# Altium project MB988.PrjPCB (part 2 of 2)

## Sheet Audio.SchDoc
size A4; Revision: B.2
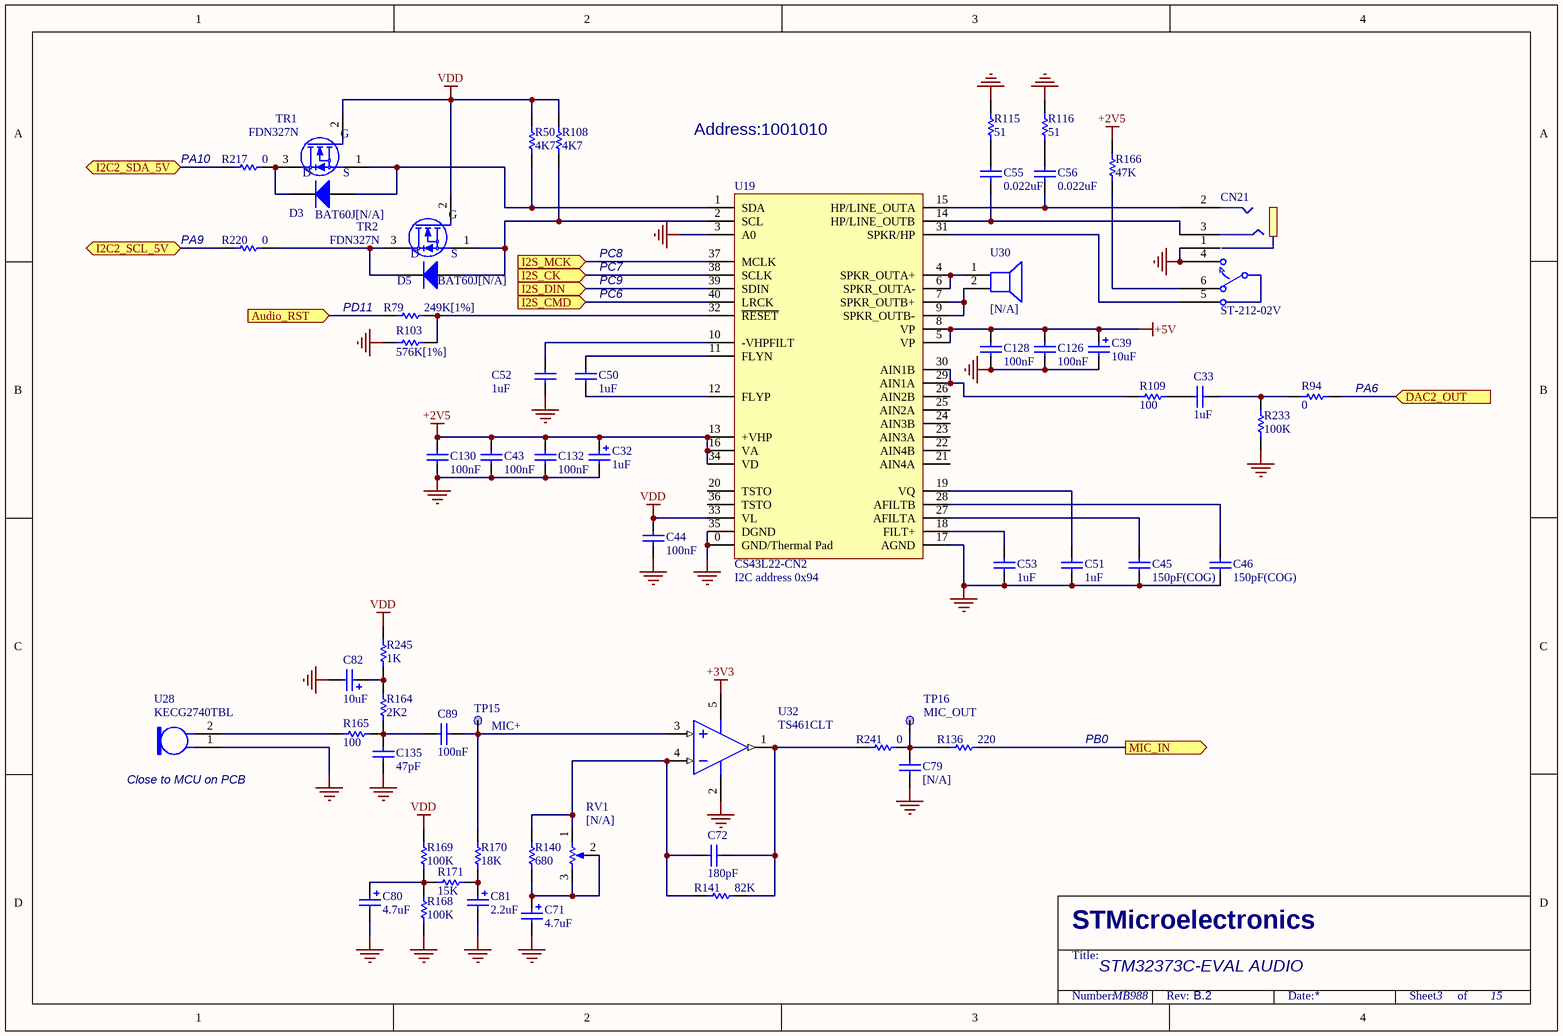
[diagram p9: Audio.SchDoc]

### Parts
C32  1uF  [TAN-A]
C33  1uF  [0603C]
C39  10uF  [TAN-A]
C43  100nF  [0603C]
C44  100nF  [0603C]
C45  150pF(COG)  [0603C]
C46  150pF(COG)  [0603C]
C50  1uF  [0603C]
C51  1uF  [0603C]
C52  1uF  [0603C]
C53  1uF  [0603C]
C55  0.022uF  [0603C]
C56  0.022uF  [0603C]
C71  4.7uF  [TAN-A]
C72  180pF  [0603C]
C79  [N/A]  [0603C]
C80  4.7uF  [TAN-A]
C81  2.2uF  [0805C]
C82  10uF  [TAN-A]
C89  100nF  [0603C]
C126  100nF  [0603C]
C128  100nF  [0603C]
C130  100nF  [0603C]
C132  100nF  [0603C]
C135  47pF  [0603C]
CN21  ST-212-02V  [ST-212-02V]
D3  BAT60J[N/A]  [SOD-323]
D5  BAT60J[N/A]  [SOD-323]
R50  4K7  [0603R]
R79  249K[1%]  [0603R]
R94  0  [0603R]
R103  576K[1%]  [0603R]
R108  4K7  [0603R]
R109  100  [0603R]
R115  51  [0603R]
R116  51  [0603R]
R136  220  [0603R]
R140  680  [0603R]
R141  82K  [0603R]
R164  2K2  [0603R]
R165  100  [0603R]
R166  47K  [0603R]
R168  100K  [0603R]
R169  100K  [0603R]
R170  18K  [0603R]
R171  15K  [0603R]
R217  0  [0603R]
R220  0  [0603R]
R233  100K  [0603R]
R241  0  [0603R]
R245  1K  [0603R]
RV1  [N/A]  [3314-J]
TP15  MIC+  [TP]
TP16  MIC_OUT  [TP]
TR1  FDN327N  [SOT-23]
TR2  FDN327N  [SOT-23]
U19  CS43L22-CN2  [QFN40(6*6)]
U28  KECG2740TBL  [KEC2740]
U30  [N/A]  [KS1708]
U32  TS461CLT  [SOT-23-5L]

### Ports
Audio_RST (in), DAC2_OUT (in), I2C2_SCL_5V (bidir), I2C2_SDA_5V (bidir), I2S_CK (in), I2S_CMD (in), I2S_DIN (in), I2S_MCK (in), MIC_IN (out)

### Nets
+2V5: C32.1 C43.1 C130.1 C132.1 R166.1 U19.13(+VHP) U19.16(VA) U19.34(VD)
+3V3: U32.5(VCC)
+5V: C39.1 C126.1 C128.1 U19.5(VP) U19.8(VP)
GND: C32.2 C39.2 C43.2 C44.2 C45.1 C46.1 C51.1 C52.2 C53.1 C71.2 C79.2 C80.2 C81.2 C82.2 C126.2 C128.2 C130.2 C132.2 C135.2 CN21.1 CN21.4 R103.1 R115.1 R116.1 R168.2 R233.2 U19.0(GND/Thermal_Pad) U19.3(A0) U19.17(AGND) U19.35(DGND) U28.1 U32.2(VDD)
VDD: C44.1 R50.2 R108.2 R169.1 R245.2 TR1.2(G) TR2.2(G) U19.33(VL)
PB0: R136.1 ; port MIC_IN
PC6: U19.40(LRCK) ; port I2S_CMD
PC7: U19.38(SCLK) ; port I2S_CK
PC8: U19.37(MCLK) ; port I2S_MCK
PC9: U19.39(SDIN) ; port I2S_DIN
PD11: R79.2 ; port Audio_RST
NetC33_1: C33.1 R109.1
NetC33_2: C33.2 R94.1 R233.1
NetC45_2: C45.2 U19.27(AFILTA)
NetC46_2: C46.2 U19.28(AFILTB)
NetC50_1: C50.1 U19.12(FLYP)
NetC50_2: C50.2 U19.11(FLYN)
NetC51_2: C51.2 U19.19(VQ)
NetC52_1: C52.1 U19.10(-VHPFILT)
NetC53_2: C53.2 U19.18(FILT+)
NetC55_1: C55.1 R115.2
NetC55_2: C55.2 CN21.3 U19.14(HP/LINE_OUTB)
NetC56_1: C56.1 R116.2
NetC56_2: C56.2 CN21.2 U19.15(HP/LINE_OUTA)
NetC71_1: C71.1 R140.2 RV1.2(TAP) RV1.3(TOP)
NetC72_1: C72.1 R140.1 R141.2 RV1.1(BOT) U32.4(IN-)
NetC72_2: C72.2 R141.1 R241.2 U32.1(OUT)
NetC79_1: C79.1 R136.2 R241.1 TP16.1
NetC80_1: C80.1 R168.1 R169.2 R171.1
NetC81_1: C81.1 R170.1 R171.2
NetC82_1: C82.1 R164.2 R245.1
NetC89_1: C89.1 C135.1 R164.1 R165.1
NetC89_2: C89.2 R170.2 TP15.1 U32.3(IN+)
NetCN2_15: R220.1 ; port I2C2_SCL_5V
NetCN2_16: R217.1 ; port I2C2_SDA_5V
NetCN21_5: CN21.5 U19.31(SPKR/HP)
NetCN21_6: CN21.6 R166.2
NetD3_1: D3.1(A) R50.1 TR1.1(S) U19.1(SDA)
NetD3_2: D3.2(K) R217.2 TR1.3(D)
NetD5_1: D5.1(A) R108.1 TR2.1(S) U19.2(SCL)
NetD5_2: D5.2(K) R220.2 TR2.3(D)
NetR79_1: R79.1 R103.2 U19.32(~{RESET})
NetR92_2: R94.2 ; port DAC2_OUT
NetR109_2: R109.2 U19.29(AIN1A) U19.30(AIN1B)
NetR165_2: R165.2 U28.2
NetU19_4: U19.4(SPKR_OUTA+) U19.6(SPKR_OUTA-) U30.1(+)
NetU19_7: U19.7(SPKR_OUTB+) U19.9(SPKR_OUTB-) U30.2(-)

Not connected (* = marked no-connect by the designer): U19 20(TSTO) 21(AIN4A) 22(AIN4B) 23(AIN3A) 24(AIN3B) 25(AIN2A) 26(AIN2B) 36(TSTO)

### Notes on the sheet
- (near R217) PA10
- Address:1001010
- (near R220) PA9
- PD11
- PC8
- PC9
- PC6
- PC7
- (near R94) PA6
- (near U19) I2C address 0x94
- (near U28) Close to MCU on PCB
- PB0
- STM32373C-EVAL AUDIO
- MB988
- 3
- 15
- STMicroelectronics
- Title:
- Number:
- Rev:
- Date:
- Sheet       of

### Library data of the parts
C32 = Cap Pol1: as C34 on sheet Power; Published: 8-Jun-2000; Revision: July-2002: Re-released for DXP Platform.; Publisher: Altium Limited
C33 C45 C46 C50-C53 C55 C56 C79 = CAP: Capacitor; Value: 100nF; Published: 8-Jun-2000; Revision: July-2002: Re-released for DXP Platform.; Publisher: Altium Limited
C39 = Cap Pol1: Polarized Capacitor (Radial); Published: 8-Jun-2000; Revision: July-2002: Re-released for DXP Platform.; Publisher: Altium Limited; Value: 10uF
C43 C44 C126 C128 C130 C132 = Cap: Capacitor; Value: 10nF; Published: 8-Jun-2000; Revision: July-2002: Re-released for DXP Platform.; Publisher: Altium Limited
C71 C80-C82 = Cap Pol1: as C3 on sheet ECG&PressureSensor; Published: 8-Jun-2000; Revision: July-2002: Re-released for DXP Platform.; Publisher: Altium Limited
C72 C89 C135 = CAP: Capacitor; Value: 100pF; Published: 8-Jun-2000; Revision: July-2002: Re-released for DXP Platform.; Publisher: Altium Limited
D3 D5 = Diode: Default Diode; Code - JEDEC: DO-214-AB; Published: 8-Jun-2000; Revision: July-2002: Re-released for DXP Platform.; Publisher: Altium Limited
R50 R108 R136 R140 R141 R164 R165 R168-R171 R217 R220 R241 = Res1: Resistor; Value: 1K; Published: 8-Jun-2000; Revision: July-2002: Re-released for DXP Platform.; Publisher: Altium Limited
R79 R94 R103 R109 R115 R116 R166 R233 = res1: Resistor; Value: 1K; Published: 8-Jun-2000; Revision: July-2002: Re-released for DXP Platform.; Publisher: Altium Limited
R245 = Res1: Resistor; Published: 8-Jun-2000; Revision: July-2002: Re-released for DXP Platform.; Publisher: Altium Limited; Value: 1K
RV1 = RV
TP15 TP16 = TP
TR1 TR2 = 2N7000
U19 = CS43L22
U28 = Mic2: Microphone; Published: 24-Mar-1999; Revision: July-2002: Re-released for DXP Platform.; Publisher: Altium Limited
U30 = Speaker: Loudspeaker; Published: 24-Mar-1999; Revision: July-2002: Re-released for DXP Platform.; Publisher: Altium Limited

## Sheet I2C Peripherals.SCHDOC
size A4; Revision: B.2
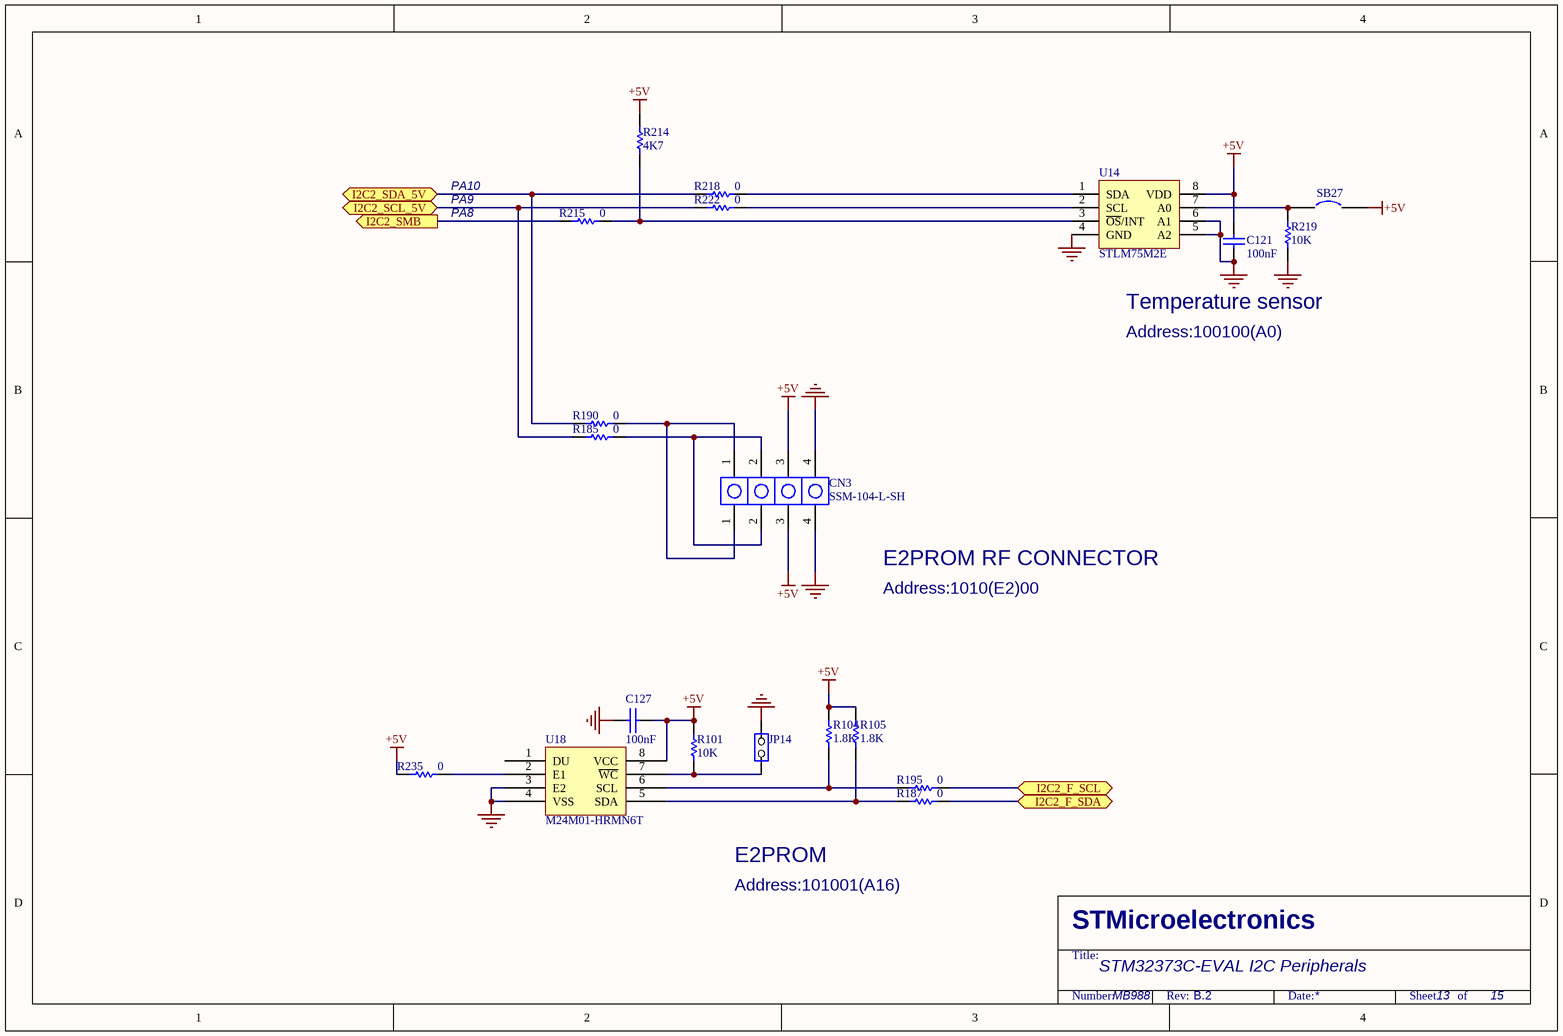
[diagram p10: I2C Peripherals.SCHDOC]

### Parts
C121  100nF  [0603C]
C127  100nF  [0603C]
CN3  SSM-104-L-SH  [SSM-104-L-SH]
JP14  (no value)  [SIP2]
R101  10K  [0603R]
R104  1.8K  [0603R]
R105  1.8K  [0603R]
R185  0  [0603R]
R187  0  [0603R]
R190  0  [0603R]
R195  0  [0603R]
R214  4K7  [0603R]
R215  0  [0603R]
R218  0  [0603R]
R219  10K  [0603R]
R222  0  [0603R]
R235  0  [0603R]
SB27  (no value)  [JP2_SMD]
U14  STLM75M2E  [SO8]
U18  M24M01-HRMN6T  [SO8]

### Ports
I2C2_F_SCL (bidir), I2C2_F_SDA (bidir), I2C2_SCL_5V (bidir), I2C2_SDA_5V (bidir), I2C2_SMB (out)

### Nets
+5V: C121.2 C127.2 CN3.3 R101.1 R104.2 R105.2 R214.2 R235.1 SB27.2 U14.8(VDD) U18.8(VCC)
GND: C121.1 C127.1 CN3.4 JP14.2(NO) R219.1 U14.4(GND) U14.5(A2) U14.6(A1) U18.3(E2) U18.4(VSS)
PA8: R215.2 ; port I2C2_SMB
NetCN2_15: R185.1 R222.1 ; port I2C2_SCL_5V
NetCN2_16: R190.1 R218.1 ; port I2C2_SDA_5V
NetCN3_1: CN3.1 R190.2
NetCN3_2: CN3.2 R185.2
NetJP4_3: R195.2 ; port I2C2_F_SCL
NetJP5_3: R187.2 ; port I2C2_F_SDA
NetJP14_1: JP14.1(COMMON) R101.2 U18.7(~{WC})
NetR104_1: R104.1 R195.1 U18.6(SCL)
NetR105_1: R105.1 R187.1 U18.5(SDA)
NetR214_1: R214.1 R215.1 U14.3(~{OS}/INT)
NetR218_2: R218.2 U14.1(SDA)
NetR219_2: R219.2 SB27.1 U14.7(A0)
NetR222_2: R222.2 U14.2(SCL)
NetR235_2: R235.2 U18.2(E1)

Not connected (* = marked no-connect by the designer): U18 1(DU)

### Notes on the sheet
- PA10
- PA9
- PA8
- Temperature sensor
- Address:100100(A0)
- E2PROM RF CONNECTOR
- Address:1010(E2)00
- Address:101001(A16)
- E2PROM
- STM32373C-EVAL I2C Peripherals
- MB988
- 13
- 15
- STMicroelectronics
- Title:
- Number:
- Rev:
- Date:
- Sheet       of

### Library data of the parts
C121 = cap: Capacitor; Value: 100pF; Published: 8-Jun-2000; Revision: July-2002: Re-released for DXP Platform.; Publisher: Altium Limited
C127 = CAP: Capacitor
JP14 = JP2
R101 = res1: Resistor; Value: 1K; Published: 8-Jun-2000; Revision: July-2002: Re-released for DXP Platform.; Publisher: Altium Limited
R104 R105 R185 R187 R190 R195 R214 R215 R218 R219 R222 R235 = Res1: Resistor; Value: 1K; Published: 8-Jun-2000; Revision: July-2002: Re-released for DXP Platform.; Publisher: Altium Limited
SB27 = Circuit Breaker: Published: 24-Mar-1999; Revision: July-2002: Re-released for DXP Platform.; Publisher: Altium Limited
U14 = STLM75DW2F
U18 = M24M01

## Sheet HDMI_CEC.SchDoc
size A4; Revision: B.2
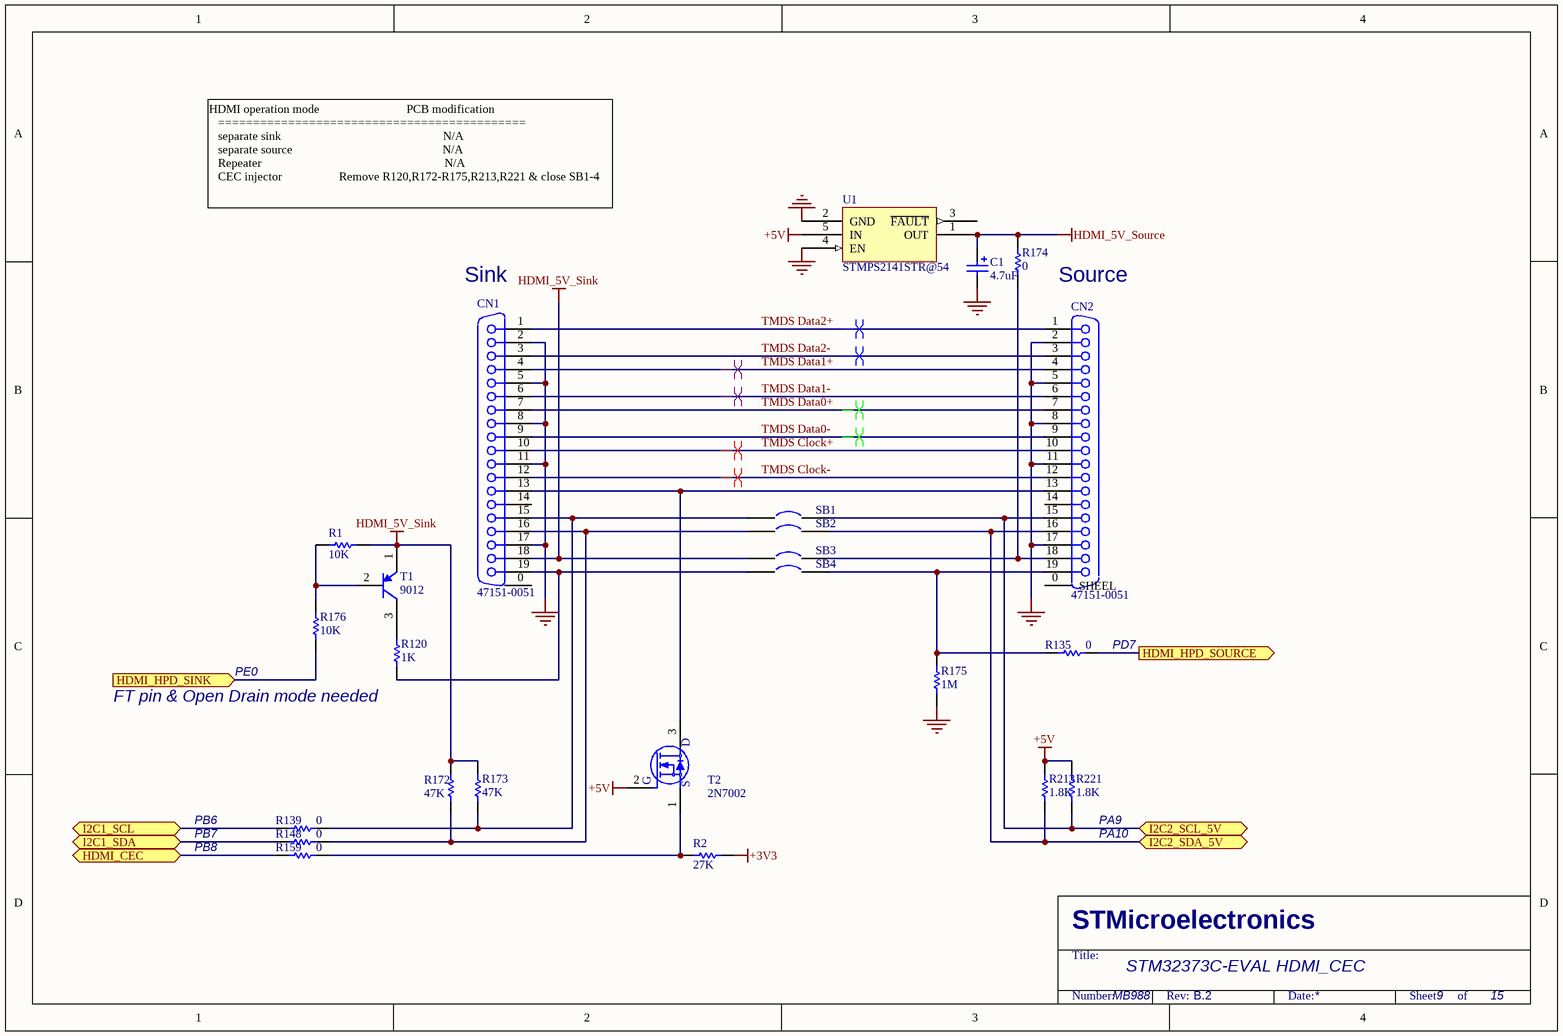
[diagram p11: HDMI_CEC.SchDoc]

### Parts
C1  4.7uF  [TAN-A]
CN1  47151-0051  [0471510051]
CN2  47151-0051  [0471510051]
R1  10K  [0603R]
R2  27K  [0603R]
R120  1K  [0603R]
R135  0  [0603R]
R139  0  [0603R]
R148  0  [0603R]
R159  0  [0603R]
R172  47K  [0603R]
R173  47K  [0603R]
R174  0  [0603R]
R175  1M  [0603R]
R176  10K  [0603R]
R213  1.8K  [0603R]
R221  1.8K  [0603R]
SB1  (no value)  [JP2_SMD]
SB2  (no value)  [JP2_SMD]
SB3  (no value)  [JP2_SMD]
SB4  (no value)  [JP2_SMD]
T1  9012  [SOT-23]
T2  2N7002  [SOT-23]
U1  STMPS2141STR@54  [SOT-23-5L]

### Ports
HDMI_CEC (bidir), HDMI_HPD_SINK (in), HDMI_HPD_SOURCE (out), I2C1_SCL (bidir), I2C1_SDA (bidir), I2C2_SCL_5V (bidir), I2C2_SDA_5V (bidir)

### Nets
+3V3: R2.2
+5V: R213.2 R221.2 T2.2(G) U1.5(IN)
GND: C1.2 CN1.2 CN1.5 CN1.8 CN1.11 CN1.17 CN2.2 CN2.5 CN2.8 CN2.11 CN2.17 R175.1 U1.2(GND) U1.4(EN)
HDMI_5V_Sink: CN1.18 R1.1 R172.2 R173.2 SB3.1 T1.1(E)
HDMI_5V_Source: C1.1 R174.1 U1.1(OUT)
PB6: R139.2 ; port I2C1_SCL
PB7: R148.2 ; port I2C1_SDA
PB8: R159.2 ; port HDMI_CEC
PD7: R135.1 ; port HDMI_HPD_SOURCE
PE0: R176.1 ; port HDMI_HPD_SINK
TMDS Clock+: CN1.10 CN2.10
TMDS Clock-: CN1.12 CN2.12
TMDS Data0+: CN1.7 CN2.7
TMDS Data0-: CN1.9 CN2.9
TMDS Data1+: CN1.4 CN2.4
TMDS Data1-: CN1.6 CN2.6
TMDS Data2+: CN1.1 CN2.1
TMDS Data2-: CN1.3 CN2.3
NetCN1_13: CN1.13 CN2.13 T2.3(D)
NetCN1_15: CN1.15 R139.1 R173.1 SB1.1
NetCN1_16: CN1.16 R148.1 R172.1 SB2.1
NetCN1_19: CN1.19 R120.1 SB4.1
NetCN2_15: CN2.15 R221.1 SB1.2 ; port I2C2_SCL_5V
NetCN2_16: CN2.16 R213.1 SB2.2 ; port I2C2_SDA_5V
NetCN2_18: CN2.18 R174.2 SB3.2
NetCN2_19: CN2.19 R135.2 R175.2 SB4.2
NetR1_2: R1.2 R176.2 T1.2(B)
NetR2_1: R2.1 R159.1 T2.1(S)
NetR120_2: R120.2 T1.3(C)

Not connected (* = marked no-connect by the designer): CN1 0(SHEEL) 14; CN2 0(SHEEL) 14; U1 3(~{FAULT})

### Layout directives
differential pair: TMDS Clock+, TMDS Clock-, TMDS Data0+, TMDS Data0-, TMDS Data1+, TMDS Data1-, TMDS Data2+, TMDS Data2-

### Notes on the sheet
- HDMI operation mode                             PCB modification
  ============================================
  separate sink                                                      N/A
  separate source                                                  N/A
  Repeater                                                             N/A
  CEC injector                   Remove R120,R172-R175,R213,R221 & close SB1-4
- (near CN1) Sink
- Source
- (near R135) PD7
- (near R120) FT pin & Open Drain mode needed
- PE0
- PB8
- PB6
- PB7
- (near R221) PA9
- PA10
- STM32373C-EVAL HDMI_CEC
- MB988
- 9
- 15
- STMicroelectronics
- Title:
- Number:
- Rev:
- Date:
- Sheet       of

### Library data of the parts
C1 = Cap Pol1: Polarized Capacitor (Radial); Value: 47uF; Published: 8-Jun-2000; Revision: July-2002: Re-released for DXP Platform.; Publisher: Altium Limited
CN1 = 47151-0051(L)
CN2 = 47151-0051(R)
R1 R2 R135 R139 R148 R159 R172-R176 R213 R221 = Res1: Resistor; Value: 1K; Published: 8-Jun-2000; Revision: July-2002: Re-released for DXP Platform.; Publisher: Altium Limited
R120 = Res1: Resistor; Published: 8-Jun-2000; Revision: July-2002: Re-released for DXP Platform.; Publisher: Altium Limited; Value: 1K
SB1-SB4 = Circuit Breaker: Published: 24-Mar-1999; Revision: July-2002: Re-released for DXP Platform.; Publisher: Altium Limited
T1 = PNP: PNP Bipolar Transistor; Published: 8-Jun-2000; Revision: July-2002: Re-released for DXP Platform.; Publisher: Altium Limited; Code - JEDEC: SOT-23
U1 = STMPS2141STR

## Sheet RS232_IrDA.SCHDOC
size A4; Revision: B.2
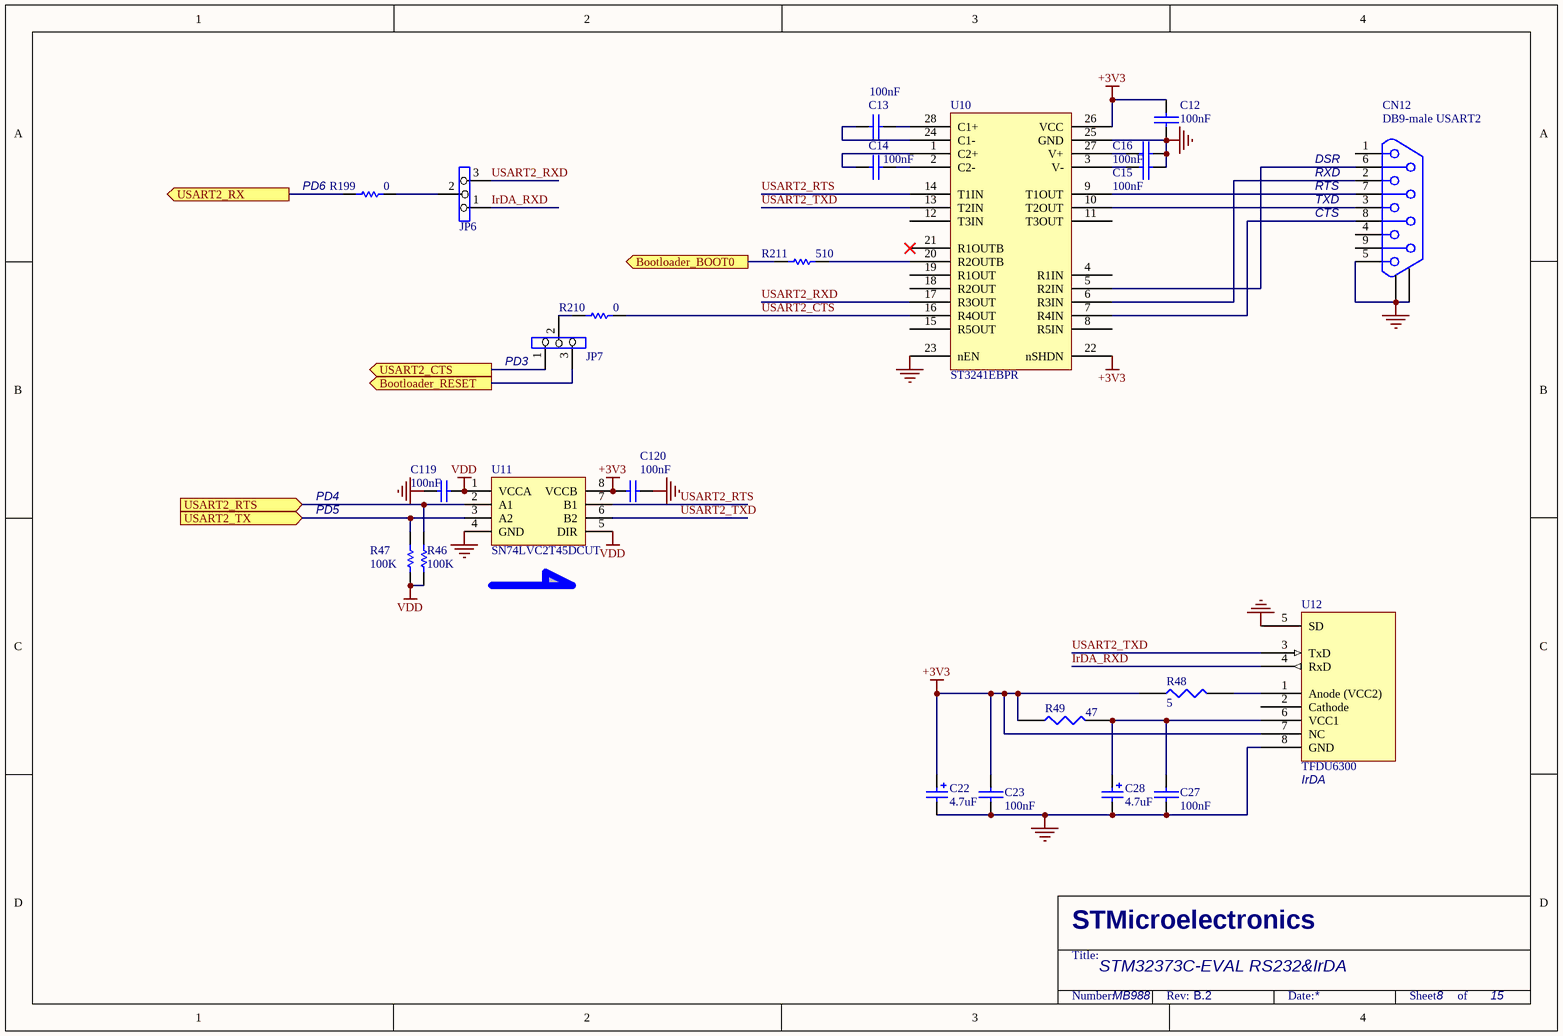
[diagram p12: RS232_IrDA.SCHDOC]

### Parts
C12  100nF  [0603C]
C13  100nF  [0603C]
C14  100nF  [0603C]
C15  100nF  [0603C]
C16  100nF  [0603C]
C22  4.7uF  [TAN-A]
C23  100nF  [0603C]
C27  100nF  [0603C]
C28  4.7uF  [TAN-A]
C119  100nF  [0603C]
C120  100nF  [0603C]
CN12  DB9-male USART2  [DB9/M]
JP6  (no value)  [SIP3]
JP7  (no value)  [SIP3]
R46  100K  [0603R]
R47  100K  [0603R]
R48  5  [0603R]
R49  47  [0603R]
R199  0  [0603R]
R210  0  [0603R]
R211  510  [0603R]
U10  ST3241EBPR  [SSOP28]
U11  SN74LVC2T45DCUT  [VSSOP8]
U12  TFDU6300  [IR_VISHAY3]

### Ports
Bootloader_BOOT0 (out), Bootloader_RESET (out), USART2_CTS (out), USART2_RTS (in), USART2_RX (out), USART2_TX (in)

### Nets
+3V3: C12.2 C22.1 C23.1 C120.2 R48.1 R49.1 U10.22(nSHDN) U10.26(VCC) U11.8(VCCB) U12.7(NC)
GND: C12.1 C15.2 C16.2 C22.2 C23.2 C27.2 C28.2 C119.1 C120.1 CN12.0 CN12.5 U10.23(nEN) U10.25(GND) U11.4(GND) U12.5(SD) U12.8(GND)
VDD: C119.2 R46.2 R47.2 U11.1(VCCA) U11.5(DIR)
IrDA_RXD: JP6.1 U12.4(RxD)
PD3: JP7.1 ; port USART2_CTS
PD4: R46.1 U11.2(A1) ; port USART2_RTS
PD5: R47.1 U11.3(A2) ; port USART2_TX
PD6: R199.1 ; port USART2_RX
USART2_CTS: R210.2 U10.16(R4OUT)
USART2_RTS: U10.14(T1IN) U11.7(B1)
USART2_RXD: JP6.3 U10.17(R3OUT)
USART2_TXD: U10.13(T2IN) U11.6(B2) U12.3(TxD)
NetC13_1: C13.1 U10.24(C1-)
NetC13_2: C13.2 U10.28(C1+)
NetC14_1: C14.1 U10.1(C2+)
NetC14_2: C14.2 U10.2(C2-)
NetC15_1: C15.1 U10.3(V-)
NetC16_1: C16.1 U10.27(V+)
NetC27_1: C27.1 C28.1 R49.2 U12.6(VCC1)
NetCN12_2: CN12.2 U10.6(R3IN)
NetCN12_3: CN12.3 U10.10(T2OUT)
NetCN12_6: CN12.6 U10.5(R2IN)
NetCN12_7: CN12.7 U10.9(T1OUT)
NetCN12_8: CN12.8 U10.7(R4IN)
NetD2_1: R211.1 ; port Bootloader_BOOT0
NetJP6_2: JP6.2 R199.2
NetJP7_2: JP7.2 R210.1
NetJP7_3: JP7.3 ; port Bootloader_RESET
NetR48_2: R48.2 U12.1(Anode_(VCC2))
NetR211_2: R211.2 U10.20(R2OUTB)

Not connected (* = marked no-connect by the designer): CN12 1 4 9; U10 4(R1IN) 8(R5IN) 11(T3OUT) 12(T3IN) 15(R5OUT) 18(R2OUT) 19(R1OUT) 21(R1OUTB)*; U12 2(Cathode)

### Notes on the sheet
- (near CN12) RXD
- (near CN12) DSR
- (near R199) PD6
- (near CN12) RTS
- (near CN12) TXD
- (near CN12) CTS
- (near JP7) PD3
- PD5
- PD4
- (near U12) IrDA
- STM32373C-EVAL RS232&IrDA
- MB988
- 8
- 15
- STMicroelectronics
- Title:
- Number:
- Rev:
- Date:
- Sheet       of

### Library data of the parts
C12-C16 C23 C27 = CAP: Capacitor
C22 C28 = Cap Pol1: Polarized Capacitor (Radial); Value: 100pF; Published: 8-Jun-2000; Revision: July-2002: Re-released for DXP Platform.; Publisher: Altium Limited
C119 C120 = CAP: Capacitor; Value: 100pF; Published: 8-Jun-2000; Revision: July-2002: Re-released for DXP Platform.; Publisher: Altium Limited
CN12 = DB9
JP6 JP7 = Jumper3
R46 R47 R199 R210 R211 = Res1: Resistor; Value: 1K; Published: 8-Jun-2000; Revision: July-2002: Re-released for DXP Platform.; Publisher: Altium Limited
R48 R49 = RES1
U10 = ST3241
U12 = TFDU4300

## Sheet Touch Slider.SchDoc
size A4; Revision: B.2
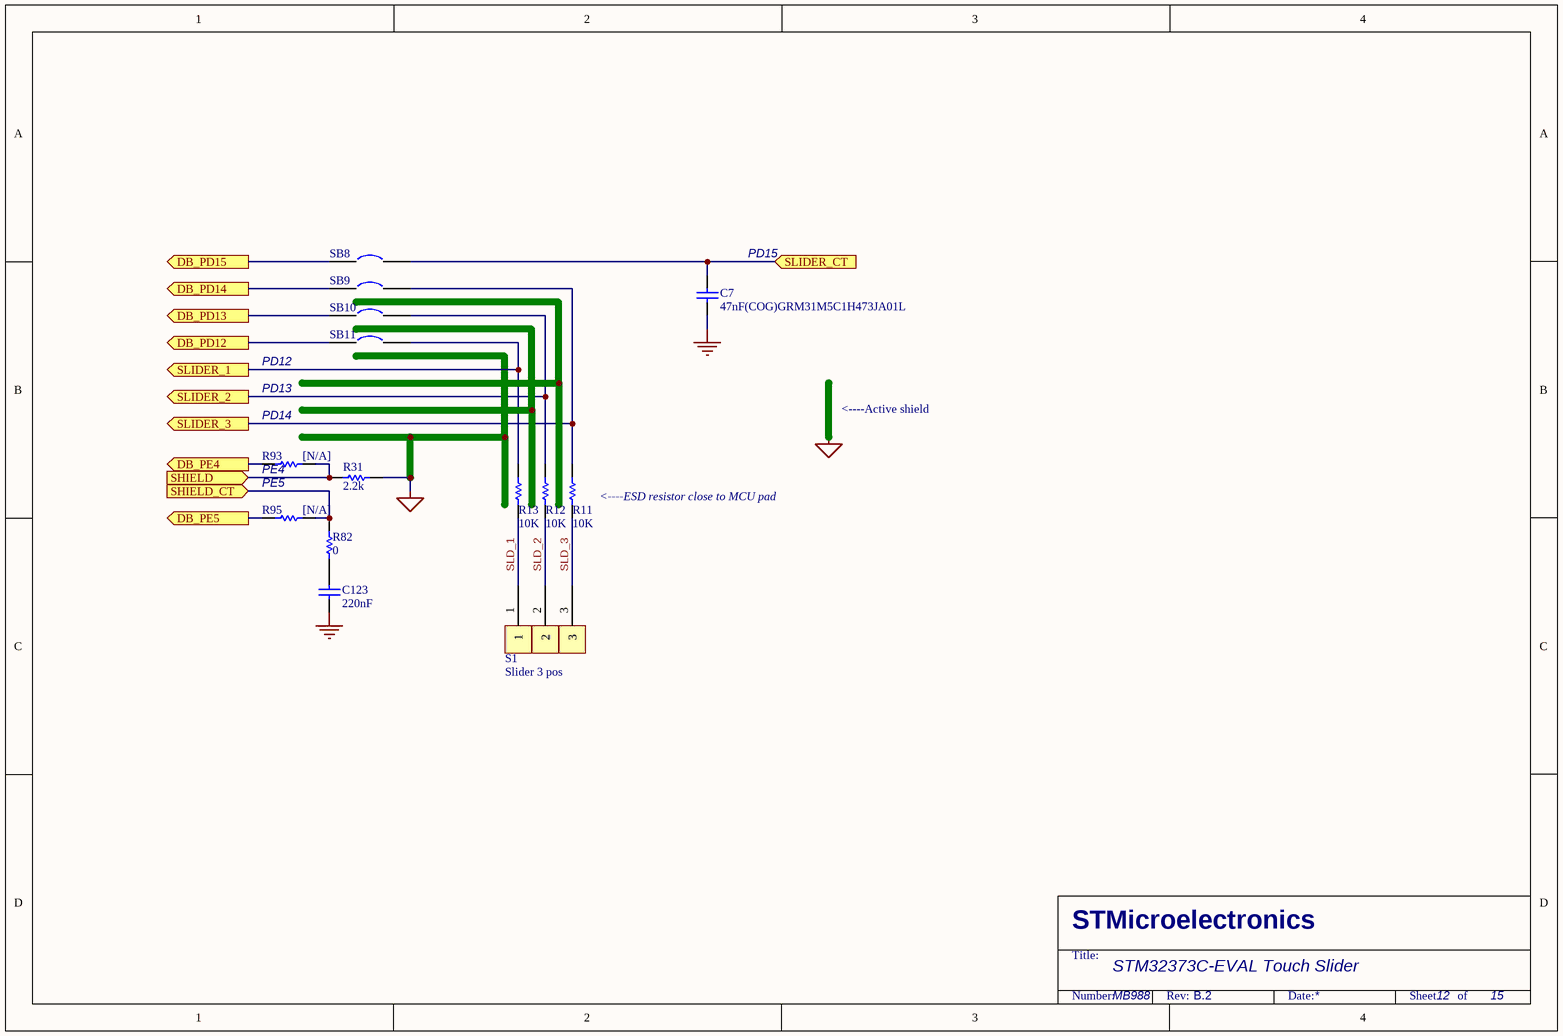
[diagram p13: Touch Slider.SchDoc]

### Parts
C7  47nF(COG)GRM31M5C1H473JA01L  [1206C]
C123  220nF  [0603C]
R11  10K  [0603R]
R12  10K  [0603R]
R13  10K  [0603R]
R31  2.2k  [0603R]
R82  0  [0603R]
R93  [N/A]  [0603R]
R95  [N/A]  [0603R]
S1  Slider 3 pos  [SLIDER3-2(50)]
SB8  (no value)  [JP2_SMD]
SB9  (no value)  [JP2_SMD]
SB10  (no value)  [JP2_SMD]
SB11  (no value)  [JP2_SMD]

### Ports
DB_PD12 (out), DB_PD13 (out), DB_PD14 (out), DB_PD15 (out), DB_PE4 (out), DB_PE5 (out), SHIELD (in), SHIELD_CT (in), SLIDER_1 (out), SLIDER_2 (out), SLIDER_3 (out), SLIDER_CT (in)

### Nets
GND: C7.1 C123.1
TS_SHIELD: R31.2
PD12: R13.1 SB11.2 ; port SLIDER_1
PD13: R12.1 SB10.2 ; port SLIDER_2
PD14: R11.1 SB9.2 ; port SLIDER_3
PD15: C7.2 SB8.2 ; port SLIDER_CT
SLD_1: R13.2 S1.1
SLD_2: R12.2 S1.2
SLD_3: R11.2 S1.3
NetC123_2: C123.2 R82.2
NetCN13_43: R95.2 ; port DB_PE5
NetCN13_44: R93.2 ; port DB_PE4
NetCN14_2: SB8.1 ; port DB_PD15
NetCN14_3: SB9.1 ; port DB_PD14
NetCN14_4: SB10.1 ; port DB_PD13
NetCN14_6: SB11.1 ; port DB_PD12
NetR29_1: R31.1 R93.1 ; port SHIELD
NetR73_1: R82.1 R95.1 ; port SHIELD_CT

### Notes on the sheet
- (near C7) PD15
- PD12
- PD13
- (near R93) PD14
- <----Active shield
- (near R93) PE4
- (near R93) PE5
- (near R11) <----ESD resistor close to MCU pad
- STM32373C-EVAL Touch Slider
- MB988
- 12
- 15
- STMicroelectronics
- Title:
- Number:
- Rev:
- Date:
- Sheet       of

### Library data of the parts
C7 C123 = CAP: Capacitor; Value: 100pF; Published: 8-Jun-2000; Revision: July-2002: Re-released for DXP Platform.; Publisher: Altium Limited
R11-R13 = res1: Resistor; Value: 1K; Published: 8-Jun-2000; Revision: July-2002: Re-released for DXP Platform.; Publisher: Altium Limited
R31 R82 R93 R95 = Res1: Resistor; Value: 1K; Published: 8-Jun-2000; Revision: July-2002: Re-released for DXP Platform.; Publisher: Altium Limited
S1 = Slider 3 pos: plan de cuivre recouvert de vernis + Couche Plastic; Description: plan de cuivre recouvert de vernis
SB8-SB11 = Circuit Breaker: Published: 24-Mar-1999; Revision: July-2002: Re-released for DXP Platform.; Publisher: Altium Limited

## Sheet CAN&IR.SchDoc
size A4; Revision: B.2
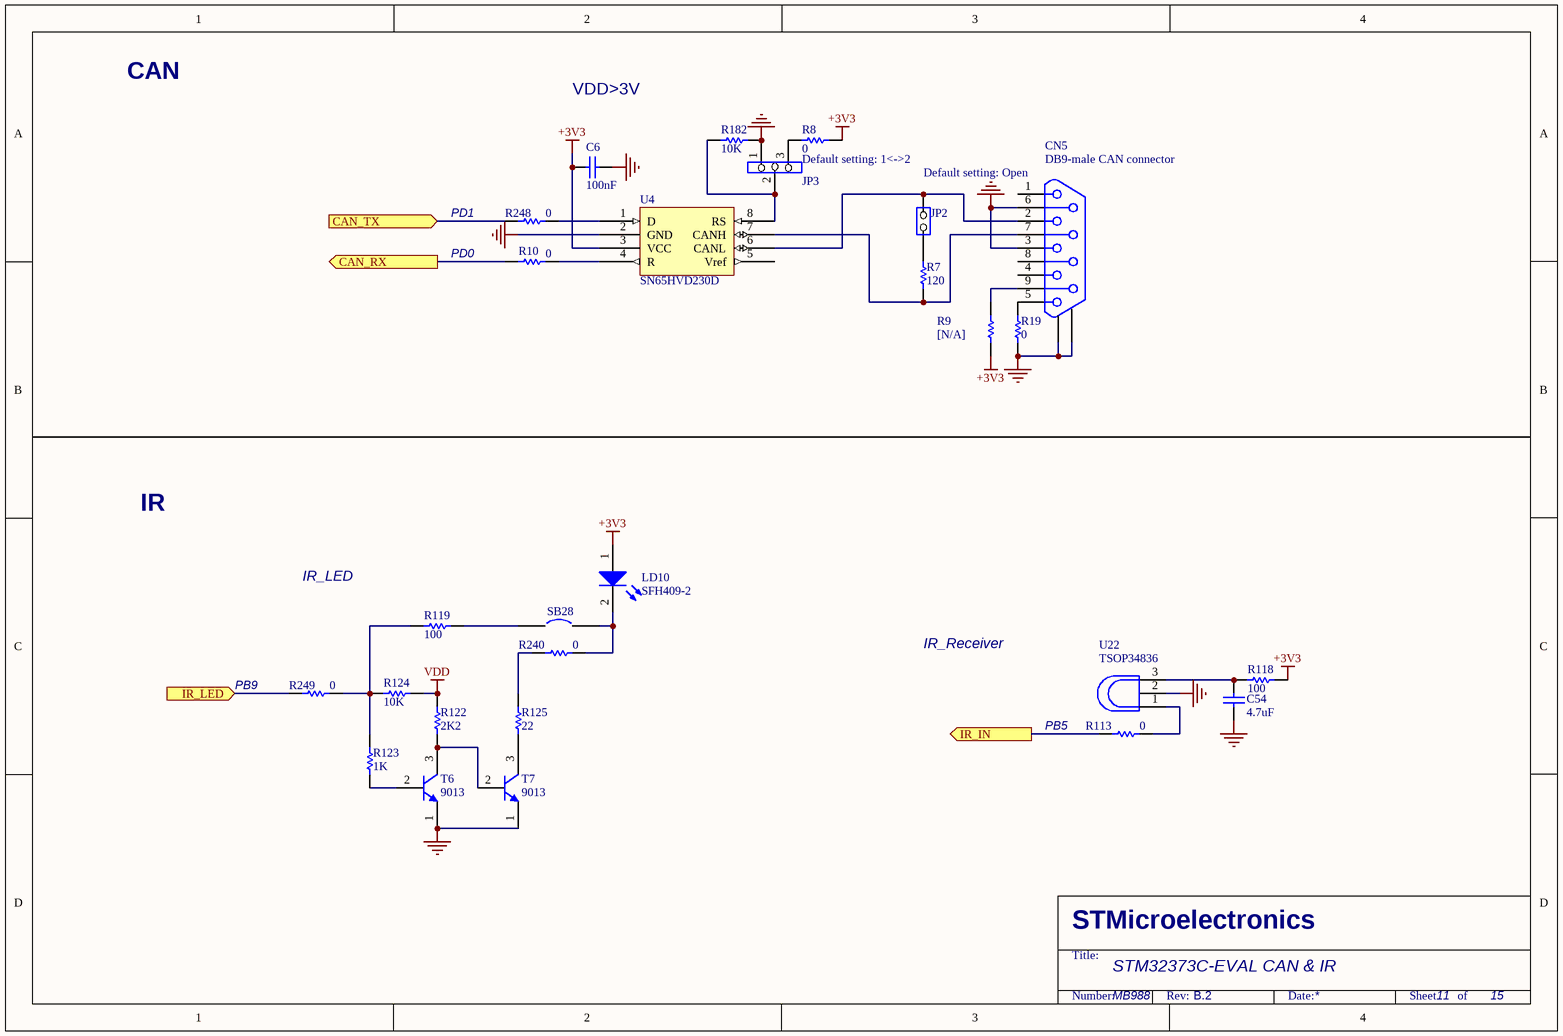
[diagram p14: CAN&IR.SchDoc]

### Parts
C6  100nF  [0603C]
C54  4.7uF  [0603C]
CN5  DB9-male CAN connector  [DB9/M]
JP2  (no value)  [SIP2]
JP3  (no value)  [SIP3]
LD10  SFH409-2  [D0.1L]
R7  120  [0603R]
R8  0  [0603R]
R9  [N/A]  [0603R]
R10  0  [0603R]
R19  0  [0603R]
R113  0  [0603R]
R118  100  [0603R]
R119  100  [0603R]
R122  2K2  [0603R]
R123  1K  [0603R]
R124  10K  [0603R]
R125  22  [0603R]
R182  10K  [0603R]
R240  0  [0603R]
R248  0  [0603R]
R249  0  [0603R]
SB28  (no value)  [JP2_SMD]
T6  9013  [SOT-23]
T7  9013  [SOT-23]
U4  SN65HVD230D  [SO8]
U22  TSOP34836  [TSOP348]

### Ports
CAN_RX (out), CAN_TX (in), IR_IN (out), IR_LED (in)

### Nets
+3V3: C6.2 LD10.1(A) R8.2 R9.1 R118.2 U4.3(VCC)
GND: C6.1 C54.2 CN5.0 CN5.3 CN5.6 JP3.1 R19.1 R182.2 T6.1(E) T7.1(E) U4.2(GND) U22.2(GND)
VDD: R122.2 R124.1
PB5: R113.1 ; port IR_IN
PB9: R249.2 ; port IR_LED
PD0: R10.1 ; port CAN_RX
PD1: R248.2 ; port CAN_TX
NetC54_1: C54.1 R118.1 U22.3(Vs)
NetCN5_2: CN5.2 JP2.2(NO) U4.6(CANL)
NetCN5_5: CN5.5 R19.2
NetCN5_7: CN5.7 R7.1 U4.7(CANH)
NetCN5_9: CN5.9 R9.2
NetJP2_1: JP2.1(COMMON) R7.2
NetJP3_2: JP3.2 R182.1 U4.8(RS)
NetJP3_3: JP3.3 R8.1
NetLD10_2: LD10.2(K) R240.2 SB28.2
NetR10_2: R10.2 U4.4(R)
NetR113_2: R113.2 U22.1(OUT)
NetR119_1: R119.1 SB28.1
NetR119_2: R119.2 R123.1 R124.2 R249.1
NetR122_1: R122.1 T6.3(C) T7.2(B)
NetR123_2: R123.2 T6.2(B)
NetR125_1: R125.1 T7.3(C)
NetR125_2: R125.2 R240.1
NetR248_1: R248.1 U4.1(D)

Not connected (* = marked no-connect by the designer): CN5 1 4 8; U4 5(Vref)

### Notes on the sheet
- CAN
- VDD>3V
- Default setting: 1<->2
- (near CN5) Default setting: Open
- PD1
- PD0
- IR
- IR_LED
- IR_Receiver
- (near R249) PB9
- PB5
- STM32373C-EVAL CAN & IR
- MB988
- 11
- 15
- STMicroelectronics
- Title:
- Number:
- Rev:
- Date:
- Sheet       of

### Library data of the parts
C6 = CAP: Capacitor; Published: 8-Jun-2000; Revision: July-2002: Re-released for DXP Platform.; Publisher: Altium Limited; Value: 100nF
C54 = Cap: Capacitor; Value: 10nF; Published: 8-Jun-2000; Revision: July-2002: Re-released for DXP Platform.; Publisher: Altium Limited
CN5 = DB9
JP2 = JP2
JP3 = Jumper3
LD10 = LED2: Typical RED, GREEN, YELLOW, AMBER GaAs LED; Published: 8-Jun-2000; Revision: July-2002: Re-released for DXP Platform.; Publisher: Altium Limited
R7-R9 R19 R182 = res1: Resistor; Value: 1K; Published: 8-Jun-2000; Revision: July-2002: Re-released for DXP Platform.; Publisher: Altium Limited
R10 R113 R118 R119 R122 R124 R125 R240 R248 R249 = Res1: Resistor; Value: 1K; Published: 8-Jun-2000; Revision: July-2002: Re-released for DXP Platform.; Publisher: Altium Limited
R123 = Res1: Resistor; Published: 8-Jun-2000; Revision: July-2002: Re-released for DXP Platform.; Publisher: Altium Limited; Value: 1K
SB28 = Circuit Breaker: Published: 24-Mar-1999; Revision: July-2002: Re-released for DXP Platform.; Publisher: Altium Limited
T6 T7 = NPN: NPN Bipolar Transistor; Code - JEDEC: TO-226-AA; Published: 8-Jun-2000; Revision: July-2002: Re-released for DXP Platform.; Publisher: Altium Limited
U22 = TSOP34838

## Nets that join several sheets
+2V5: Power (C49.1 TP13.1 U24.2), Audio (8 pins)
+3V3: MCU (CN13.48 R206.1), Peripherals (7 pins), ST_LINK (15 pins), Power (7 pins), LCD_MicroSD (9 pins), Audio (U32.5), HDMI_CEC (R2.2), RS232_IrDA (10 pins), CAN&IR (6 pins)
+5V: ECG&PressureSensor (L2.2), Power (13 pins), LCD_MicroSD (R238.1), Audio (5 pins), I2C Peripherals (11 pins), HDMI_CEC (R213.2 R221.2 T2.2 U1.5)
AGND: ECG&PressureSensor (20 pins), TemSensor&CON (17 pins), Power (16 pins)
D5V: MCU (CN13.49 CN14.19), Power (JP10.1)
GND: MCU (21 pins), Peripherals (22 pins), TemSensor&CON (6 pins), JTAG&Trace (27 pins), ST_LINK (27 pins), Power (48 pins), LCD_MicroSD (9 pins), Audio (32 pins), I2C Peripherals (10 pins), HDMI_CEC (14 pins), RS232_IrDA (16 pins), Touch Slider (C7.1 C123.1), CAN&IR (12 pins)
U5V: Peripherals (C122.1 CN16.1 R86.1 U13.5), Power (JP10.3)
U5V_ST_LINK: ST_LINK (C134.1 CN22.1 R131.1 U29.5), Power (JP10.7)
VDD: MCU (CN14.24 R155.2 SW1.1), Peripherals (8 pins), JTAG&Trace (8 pins), ST_LINK (C131.1 R134.1 U23.8), Power (5 pins), LCD_MicroSD (C125.2 TR3.2 U15.1 U15.5), Audio (8 pins), RS232_IrDA (5 pins), CAN&IR (R122.2 R124.1)
VDD_ANA: ECG&PressureSensor (10 pins), TemSensor&CON (9 pins), Power (JP16.1)
NetCN2_15: MB988 (JP4.1 R189.2), Audio (R220.1), I2C Peripherals (R185.1 R222.1), HDMI_CEC (CN2.15 R221.1 SB1.2)
NetCN2_16: MB988 (JP5.1 R192.2), Audio (R217.1), I2C Peripherals (R190.1 R218.1), HDMI_CEC (CN2.16 R213.1 SB2.2)
NetCN7_2: MCU (R35.1), LCD_MicroSD (CN7.2 R28.1)
NetCN7_10: MCU (R64.1), LCD_MicroSD (CN7.10)
NetCN13_43: MCU (CN13.43), Touch Slider (R95.2)
NetCN13_44: MCU (CN13.44), Touch Slider (R93.2)
NetCN14_2: MCU (CN14.2), Touch Slider (SB8.1)
NetCN14_3: MCU (CN14.3), Touch Slider (SB9.1)
NetCN14_4: MCU (CN14.4), Touch Slider (SB10.1)
NetCN14_6: MCU (CN14.6), Touch Slider (SB11.1)
NetCN15_18: MCU (R83.1), JTAG&Trace (CN15.18)
NetCN15_20: MCU (R85.1), JTAG&Trace (CN15.20)
NetD2_1: MCU (D2.1), RS232_IrDA (R211.1)
NetJP4_3: MB988 (JP4.3 R186.2), I2C Peripherals (R195.2)
NetJP5_3: MB988 (JP5.3 R191.2), I2C Peripherals (R187.2)
NetJP7_3: MCU (JP8.2), RS232_IrDA (JP7.3)
NetR29_1: MCU (R29.1), Touch Slider (R31.1 R93.1)
NetR72_1: MCU (R72.1), JTAG&Trace (R74.2)
NetR73_1: MCU (R73.1), Touch Slider (R82.1 R95.1)
NetR92_2: MCU (R92.2), Audio (R94.2)
NetR201_2: MCU (R201.2), ECG&PressureSensor (U3.12)
PA0: MCU (CN14.44 U9.23), Peripherals (R150.2)
PA1: MCU (CN14.43 U9.24), TemSensor&CON (R62.2)
PA2: MCU (CN14.42 U9.25), Peripherals (R90.2)
PA3: MCU (CN14.41 U9.26), TemSensor&CON (R54.1)
PA4: MCU (CN14.38 U9.29), TemSensor&CON (R43.1)
PA5: MCU (CN14.37 U9.30), TemSensor&CON (R40.1)
PA8: MCU (CN13.6 U9.67), I2C Peripherals (R215.2)
PA9: MB988 (JP4.2 R186.1 R189.1), MCU (CN13.8 U9.68)
PA10: MB988 (JP5.2 R191.1 R192.1), MCU (CN13.7 U9.69)
PA11: MCU (CN13.9 U9.70), Peripherals (R61.1)
PA12: MCU (CN13.12 U9.71), Peripherals (R75.1)
PA13: MCU (CN13.13 U9.72), JTAG&Trace (RS1.13), ST_LINK (U23.7 U27.27)
PA14: MCU (CN13.16 U9.76), JTAG&Trace (RS1.11), ST_LINK (U27.15 U27.26)
PA15: MCU (CN13.17 U9.77), JTAG&Trace (RS1.7), ST_LINK (U27.17)
PB0: MCU (CN14.32 U9.35), Audio (R136.1)
PB1: MCU (C62.2 CN14.31 U9.36), TemSensor&CON (R52.1)
PB2: MCU (CN14.29 U9.37), Power (R98.1)
PB3: MCU (CN13.31 U9.89), JTAG&Trace (RS1.9), ST_LINK (U23.6)
PB4: MCU (CN13.32 U9.90), JTAG&Trace (RS1.5), ST_LINK (U27.19)
PB5: MCU (CN13.33 U9.91), CAN&IR (R113.1)
PB6: MCU (CN13.34 U9.92), HDMI_CEC (R139.2)
PB7: MCU (CN13.35 U9.93), HDMI_CEC (R148.2)
PB8: MCU (CN13.36 U9.95), HDMI_CEC (R159.2)
PB9: MCU (CN13.37 U9.96), CAN&IR (R249.2)
PC0: MCU (CN14.49 U9.15), Peripherals (R88.1)
PC1: MCU (CN14.48 U9.16), Peripherals (R78.1)
PC2: MCU (CN14.47 U9.17), Peripherals (R77.1)
PC3: MCU (CN14.46 U9.18), Peripherals (R87.1)
PC5: MCU (CN14.33 U9.34), Peripherals (R51.2)
PC6: MCU (CN13.2 U9.63), Audio (U19.40)
PC7: MCU (CN13.3 U9.64), Audio (U19.38)
PC8: MCU (CN13.4 U9.65), Audio (U19.37)
PC9: MCU (CN13.5 U9.66), Audio (U19.39)
PC10: MCU (CN13.18 U9.78), LCD_MicroSD (U15.2)
PC11: MCU (CN13.20 U9.79), LCD_MicroSD (R24.1)
PC12: MCU (CN13.22 U9.80), LCD_MicroSD (U15.3)
PD0: MCU (CN13.21 U9.81), CAN&IR (R10.1)
PD1: MCU (CN13.24 U9.82), CAN&IR (R248.2)
PD2: MCU (CN13.23 U9.83), LCD_MicroSD (R163.2)
PD3: MCU (CN13.26 U9.84), RS232_IrDA (JP7.1)
PD4: MCU (CN13.25 U9.85), RS232_IrDA (R46.1 U11.2)
PD5: MCU (CN13.28 U9.86), RS232_IrDA (R47.1 U11.3)
PD6: MCU (CN13.27 U9.87), RS232_IrDA (R199.1)
PD7: MCU (CN13.29 U9.88), HDMI_CEC (R135.1)
PD11: MCU (CN14.5 U9.58), Audio (R79.2)
PD12: MCU (U9.59), Touch Slider (R13.1 SB11.2)
PD13: MCU (U9.60), Touch Slider (R12.1 SB10.2)
PD14: MCU (U9.61), Touch Slider (R11.1 SB9.2)
PD15: MCU (U9.62), Touch Slider (C7.2 SB8.2)
PE0: MCU (CN13.38 U9.97), HDMI_CEC (R176.1)
PE2: MCU (CN13.42 R35.2 U9.1), JTAG&Trace (CN15.12)
PE3: MCU (CN13.41 R64.2 U9.2), JTAG&Trace (R60.2)
PE6: MCU (CN13.46 R85.2 U9.5), Peripherals (R89.2)
PE7: MCU (SB18.2 U9.38), TemSensor&CON (C11.1 C17.2 R34.1)
PE8: MCU (SB16.1 U9.39), ECG&PressureSensor (C10.1 R23.1)
PE9: MCU (SB17.1 U9.40), ECG&PressureSensor (C9.1 R21.1)
PE11: MCU (CN14.21 U9.42), TemSensor&CON (R39.1)
PE12: MCU (SB13.2 U9.43), ECG&PressureSensor (R14.1 R183.1)
PE14: MCU (CN14.17 U9.45), ECG&PressureSensor (R196.1)
PF2: MCU (CN14.45 U9.19), Peripherals (R67.2)
PF4: MCU (CN14.40 U9.27), Peripherals (R68.2)
PF9: MCU (CN13.45 U9.10), Peripherals (R91.2)
PF10: MCU (CN13.47 U9.11), Peripherals (R69.2)
RESET#: MCU (7 pins), JTAG&Trace (RS1.3), ST_LINK (U27.18), LCD_MicroSD (TR3.1)